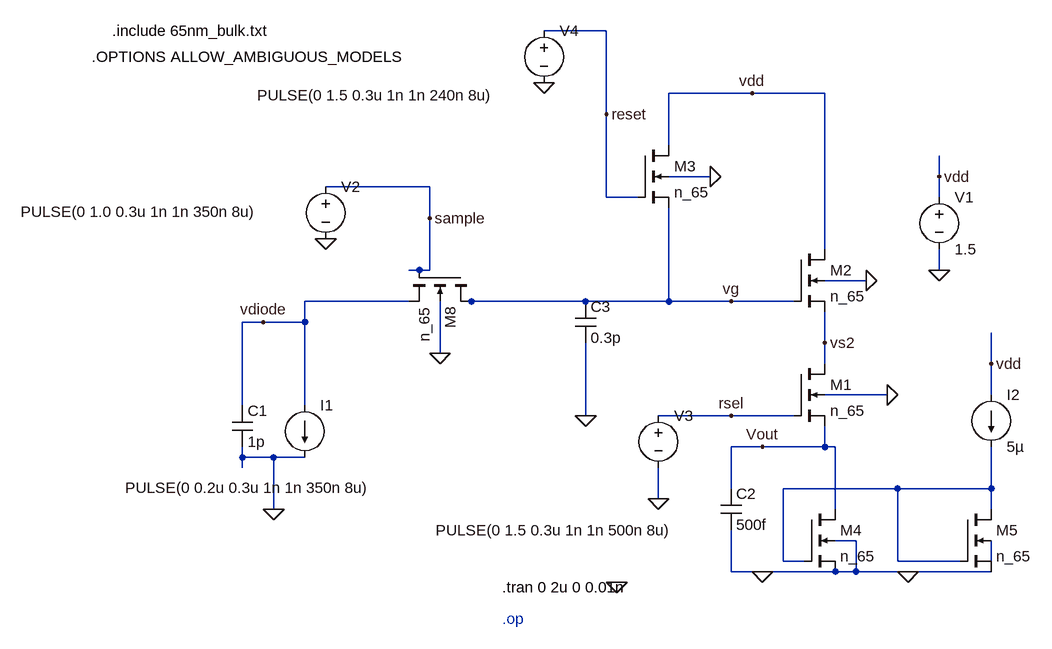
[diagram p0: schematic APS_5T.asc]
APS_5T.asc, the LTspice schematic file:
Version 4.1
SHEET 1 880 680
WIRE -96 -480 -192 -480
WIRE 128 -384 0 -384
WIRE 240 -384 128 -384
WIRE -96 -352 -96 -480
WIRE 0 -304 0 -384
WIRE 64 -256 0 -256
WIRE 416 -256 416 -288
WIRE -368 -240 -528 -240
WIRE -96 -224 -96 -352
WIRE -48 -224 -96 -224
WIRE 416 -224 416 -256
WIRE -368 -192 -368 -240
WIRE 240 -144 240 -384
WIRE -384 -112 -400 -112
WIRE -368 -112 -368 -192
WIRE -368 -112 -384 -112
WIRE 416 -112 416 -144
WIRE 304 -96 240 -96
WIRE -400 -64 -560 -64
WIRE -304 -64 -320 -64
WIRE -128 -64 -304 -64
WIRE 0 -64 0 -208
WIRE 0 -64 -128 -64
WIRE 96 -64 0 -64
WIRE 192 -64 96 -64
WIRE -624 -32 -656 -32
WIRE -560 -32 -560 -64
WIRE -560 -32 -624 -32
WIRE 240 0 240 -48
WIRE -352 16 -352 -64
WIRE -336 16 -352 16
WIRE 240 32 240 0
WIRE 496 32 496 -16
WIRE 336 80 240 80
WIRE 496 80 496 32
WIRE -656 96 -656 -32
WIRE -560 96 -560 -32
WIRE -128 112 -128 0
WIRE 96 112 -16 112
WIRE 192 112 96 112
WIRE 144 160 96 160
WIRE 240 160 240 128
WIRE 240 160 144 160
WIRE 256 160 240 160
WIRE -656 176 -656 160
WIRE -608 176 -656 176
WIRE -560 176 -608 176
WIRE -656 192 -656 176
WIRE 96 224 96 160
WIRE 352 224 176 224
WIRE 496 224 496 160
WIRE 496 224 352 224
WIRE -16 240 -16 192
WIRE -608 256 -608 176
WIRE 256 256 256 160
WIRE 496 256 496 224
WIRE 288 304 256 304
WIRE 176 336 176 224
WIRE 208 336 176 336
WIRE 352 336 352 224
WIRE 448 336 352 336
WIRE 496 336 496 304
WIRE 96 352 96 288
WIRE 144 352 96 352
WIRE 256 352 144 352
WIRE 288 352 288 304
WIRE 288 352 256 352
WIRE 368 352 288 352
WIRE 496 352 368 352
FLAG -608 256 0
FLAG 416 -112 0
FLAG 416 -256 vdd
FLAG 368 352 0
FLAG -528 -160 0
FLAG 144 352 0
FLAG 336 80 0
FLAG 304 -96 0
FLAG 64 -256 0
FLAG 496 32 vdd
FLAG 128 -384 vdd
FLAG -16 240 0
FLAG 144 160 Vout
FLAG 96 -64 vg
FLAG 96 112 rsel
FLAG 240 0 vs2
FLAG -128 112 0
FLAG -352 16 0
FLAG -192 -400 0
FLAG -96 -352 reset
FLAG -368 -192 sample
FLAG -624 -32 vdiode
FLAG -80 368 0
SYMBOL nmos4 192 32 R0
SYMATTR InstName M1
SYMATTR Value n_65
SYMATTR Value2 l=65n w=1u
SYMBOL nmos4 192 -144 R0
SYMATTR InstName M2
SYMATTR Value n_65
SYMATTR Value2 l=65n w=4u
SYMBOL nmos4 -48 -304 R0
SYMATTR InstName M3
SYMATTR Value n_65
SYMATTR Value2 l=65n w=0.5u
SYMBOL current -560 96 R0
WINDOW 123 0 0 Left 0
WINDOW 39 0 0 Left 0
WINDOW 3 -276 127 Left 2
SYMATTR Value PULSE(0 0.2u 0.3u 1n 1n 350n 8u)
SYMATTR InstName I1
SYMBOL cap -672 96 R0
SYMATTR InstName C1
SYMATTR Value 1p
SYMBOL voltage 416 -240 R0
WINDOW 123 0 0 Left 0
WINDOW 39 0 0 Left 0
SYMATTR InstName V1
SYMATTR Value 1.5
SYMBOL nmos4 208 256 R0
SYMATTR InstName M4
SYMATTR Value n_65
SYMATTR Value2 l=0.5u w=4u
SYMBOL nmos4 448 256 R0
SYMATTR InstName M5
SYMATTR Value n_65
SYMATTR Value2 l=0.5u w=2u
SYMBOL voltage -528 -256 R0
WINDOW 3 -469 54 Left 2
WINDOW 123 0 0 Left 0
WINDOW 39 0 0 Left 0
SYMATTR Value PULSE(0 1.0 0.3u 1n 1n 350n 8u)
SYMATTR InstName V2
SYMBOL current 496 80 R0
WINDOW 123 0 0 Left 0
WINDOW 39 0 0 Left 0
SYMATTR InstName I2
SYMATTR Value 5µ
SYMBOL cap 80 224 R0
SYMATTR InstName C2
SYMATTR Value 500f
SYMBOL voltage -16 96 R0
WINDOW 3 -343 192 Left 2
WINDOW 123 0 0 Left 0
WINDOW 39 0 0 Left 0
SYMATTR Value PULSE(0 1.5 0.3u 1n 1n 500n 8u)
SYMATTR InstName V3
SYMBOL nmos4 -304 -112 R90
SYMATTR InstName M8
SYMATTR Value n_65
SYMATTR Value2 l=2u w=2u
SYMBOL voltage -192 -496 R0
WINDOW 3 -441 115 Left 2
WINDOW 123 0 0 Left 0
WINDOW 39 0 0 Left 0
SYMATTR Value PULSE(0 1.5 0.3u 1n 1n 240n 8u)
SYMATTR InstName V4
SYMBOL cap -144 -64 R0
SYMATTR InstName C3
SYMATTR Value 0.3p
TEXT -256 376 Left 2 !.tran 0 2u 0 0.01n
TEXT -256 424 Left 2 ;.op
TEXT -856 -480 Left 2 !.include 65nm_bulk.txt
TEXT -888 -440 Left 2 !.OPTIONS ALLOW_AMBIGUOUS_MODELS

The netlist it stands for:
* APS_5T.asc
M1 vs2 rsel Vout 0 n_65 l=65n w=1u
M2 vdd vg vs2 0 n_65 l=65n w=4u
M3 vdd reset vg 0 n_65 l=65n w=0.5u
I1 vdiode 0 PULSE(0 0.2u 0.3u 1n 1n 350n 8u)
C1 vdiode 0 1p
V1 vdd 0 1.5
M4 Vout N001 0 0 n_65 l=0.5u w=4u
M5 N001 N001 0 N002 n_65 l=0.5u w=2u
V2 sample 0 PULSE(0 1.0 0.3u 1n 1n 350n 8u)
I2 vdd N001 5µ
C2 Vout 0 500f
V3 rsel 0 PULSE(0 1.5 0.3u 1n 1n 500n 8u)
M8 vg sample vdiode 0 n_65 l=2u w=2u
V4 reset 0 PULSE(0 1.5 0.3u 1n 1n 240n 8u)
C3 vg 0 0.3p
.model NMOS NMOS
.model PMOS PMOS
.lib standard.mos
.tran 0 2u 0 0.01n
* .op
.include 65nm_bulk.txt
.OPTIONS ALLOW_AMBIGUOUS_MODELS
.backanno
.end